# EasyEDA Pro project LED伏安特性实验仪.eprj, schematic 光磁共振

## Sheets
1 主板＋ad: Create Date: 2025-03-17; Page Name: 主板＋ad; Project Name: LED伏安特性实验仪; Schematic Name: 光磁共振; Update Date: 2025-05-20; Company: 嘉立创EDA; Page Size: A4; Version: V1.0
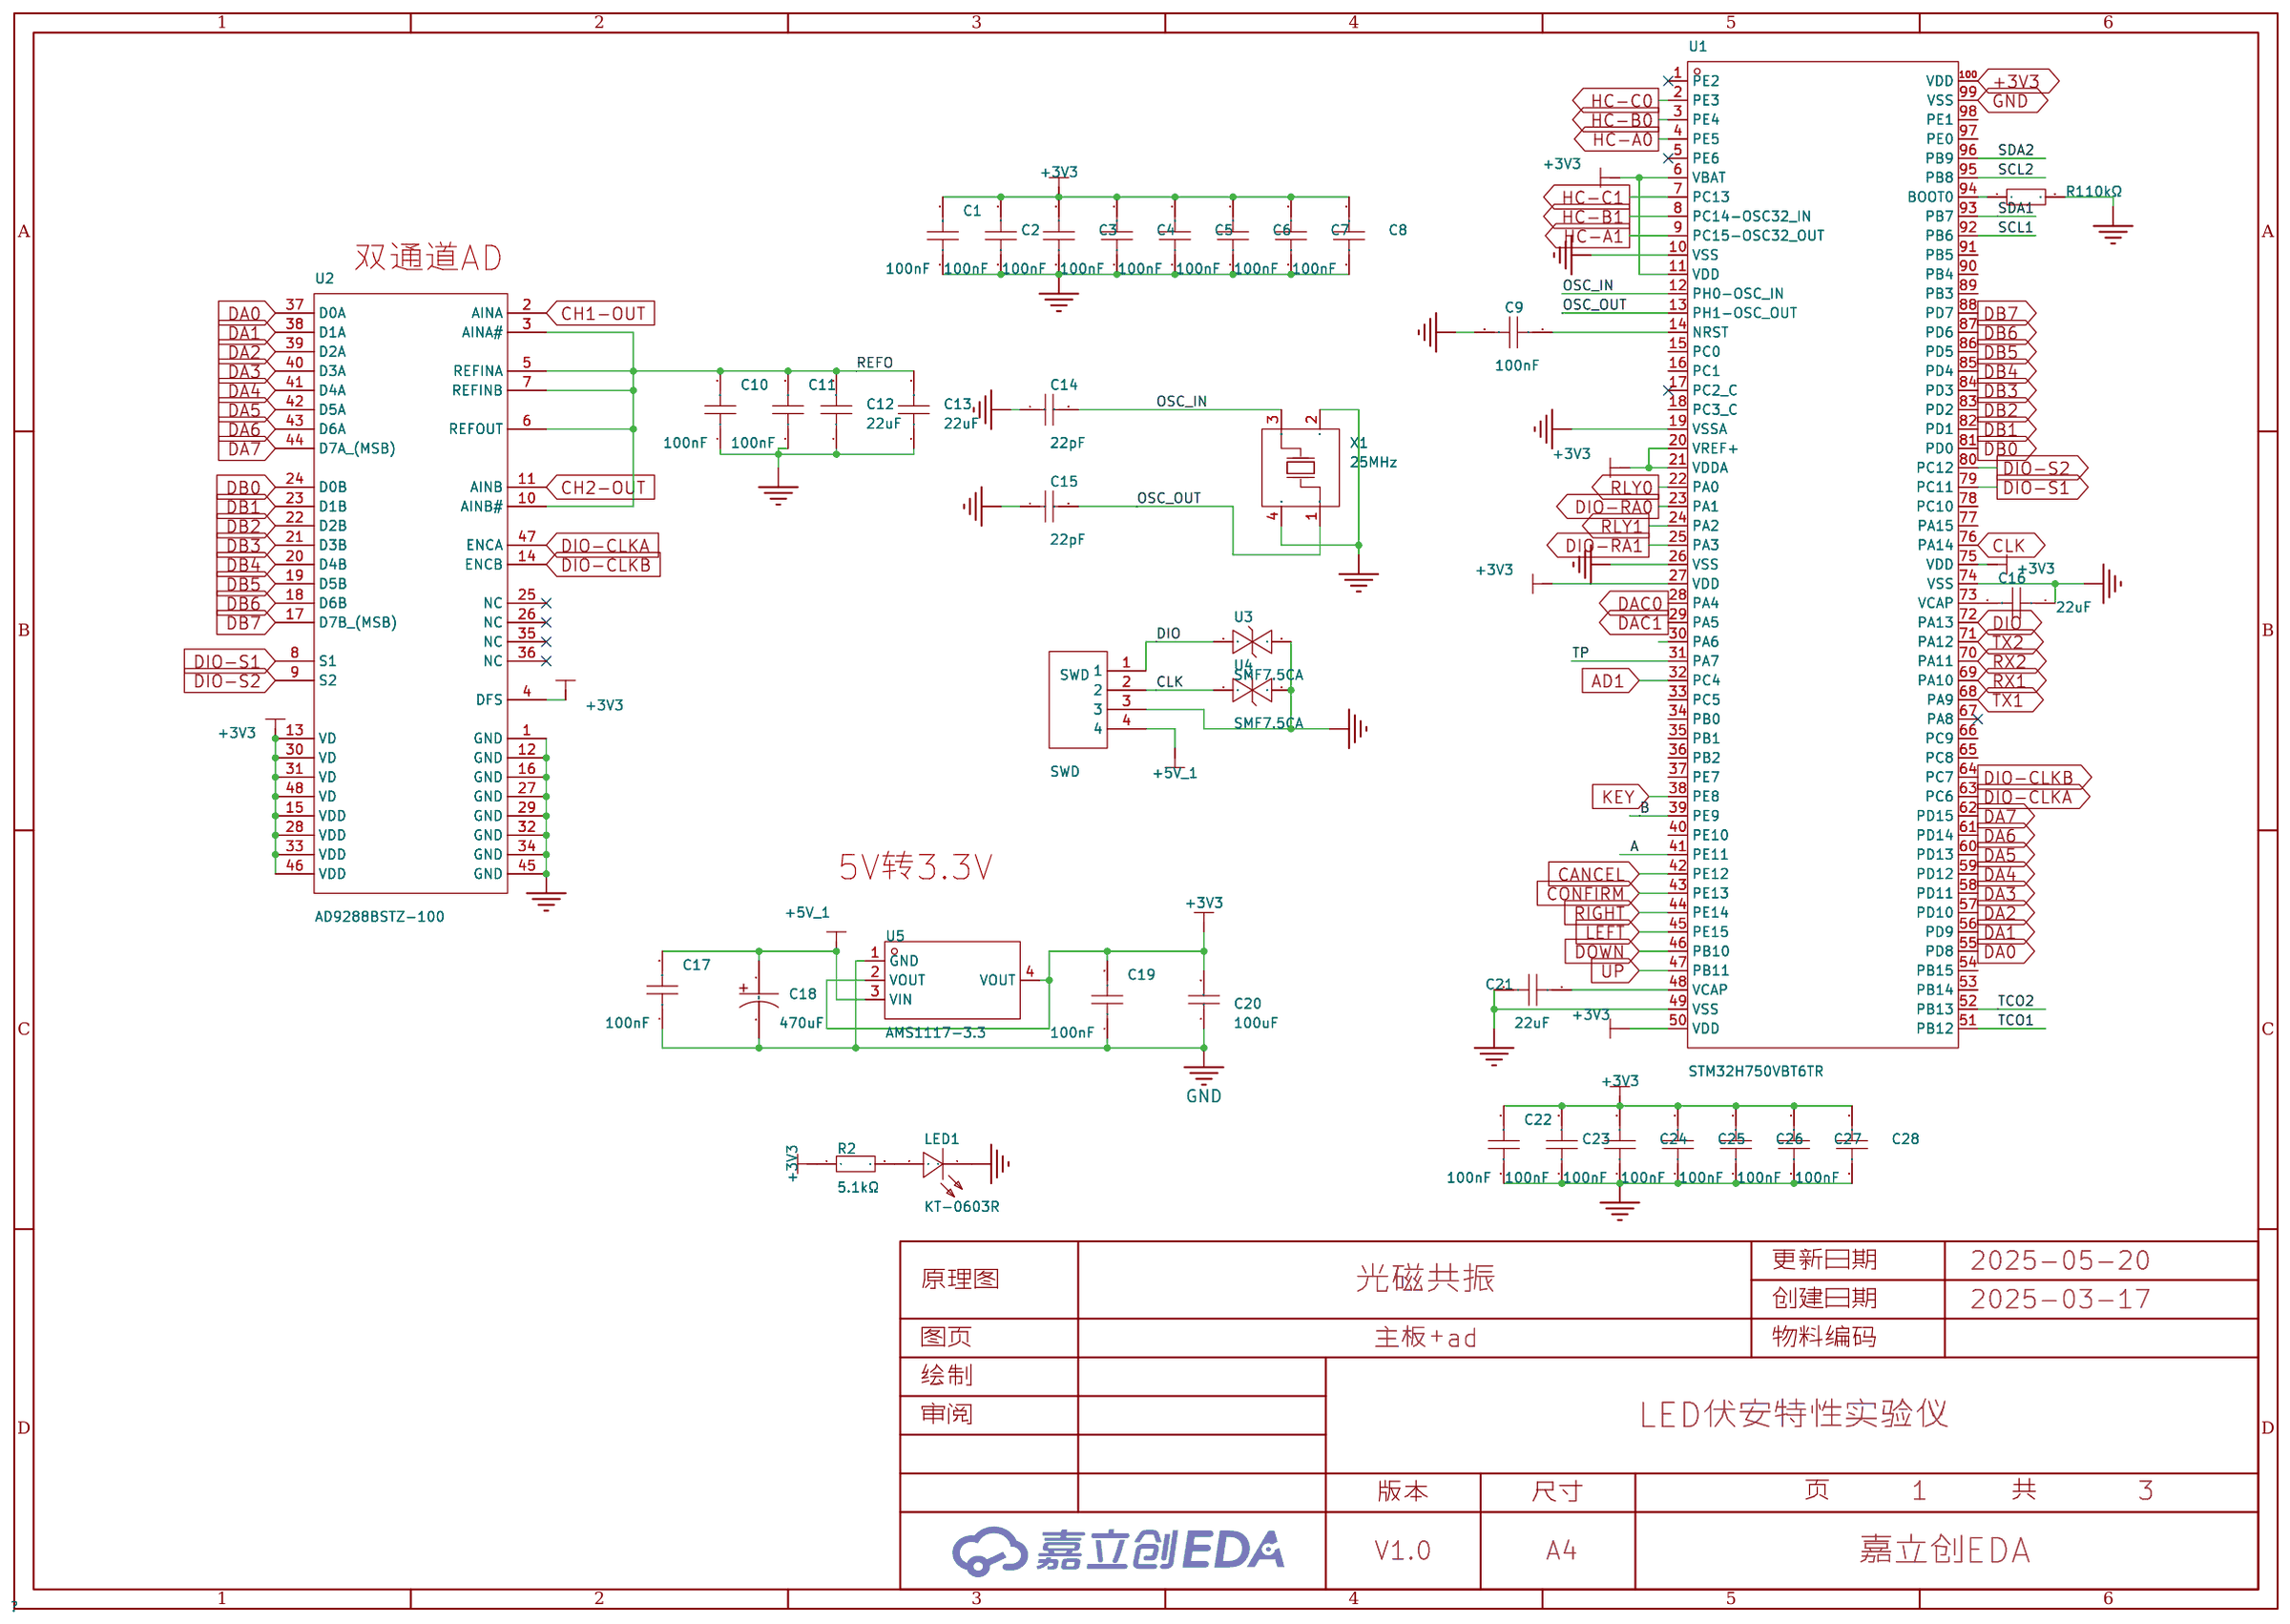
[diagram p0: 主板＋ad]
2 控温、按键、串口等: Page Name: 控温、按键、串口等; Update Date: 2026-06-05
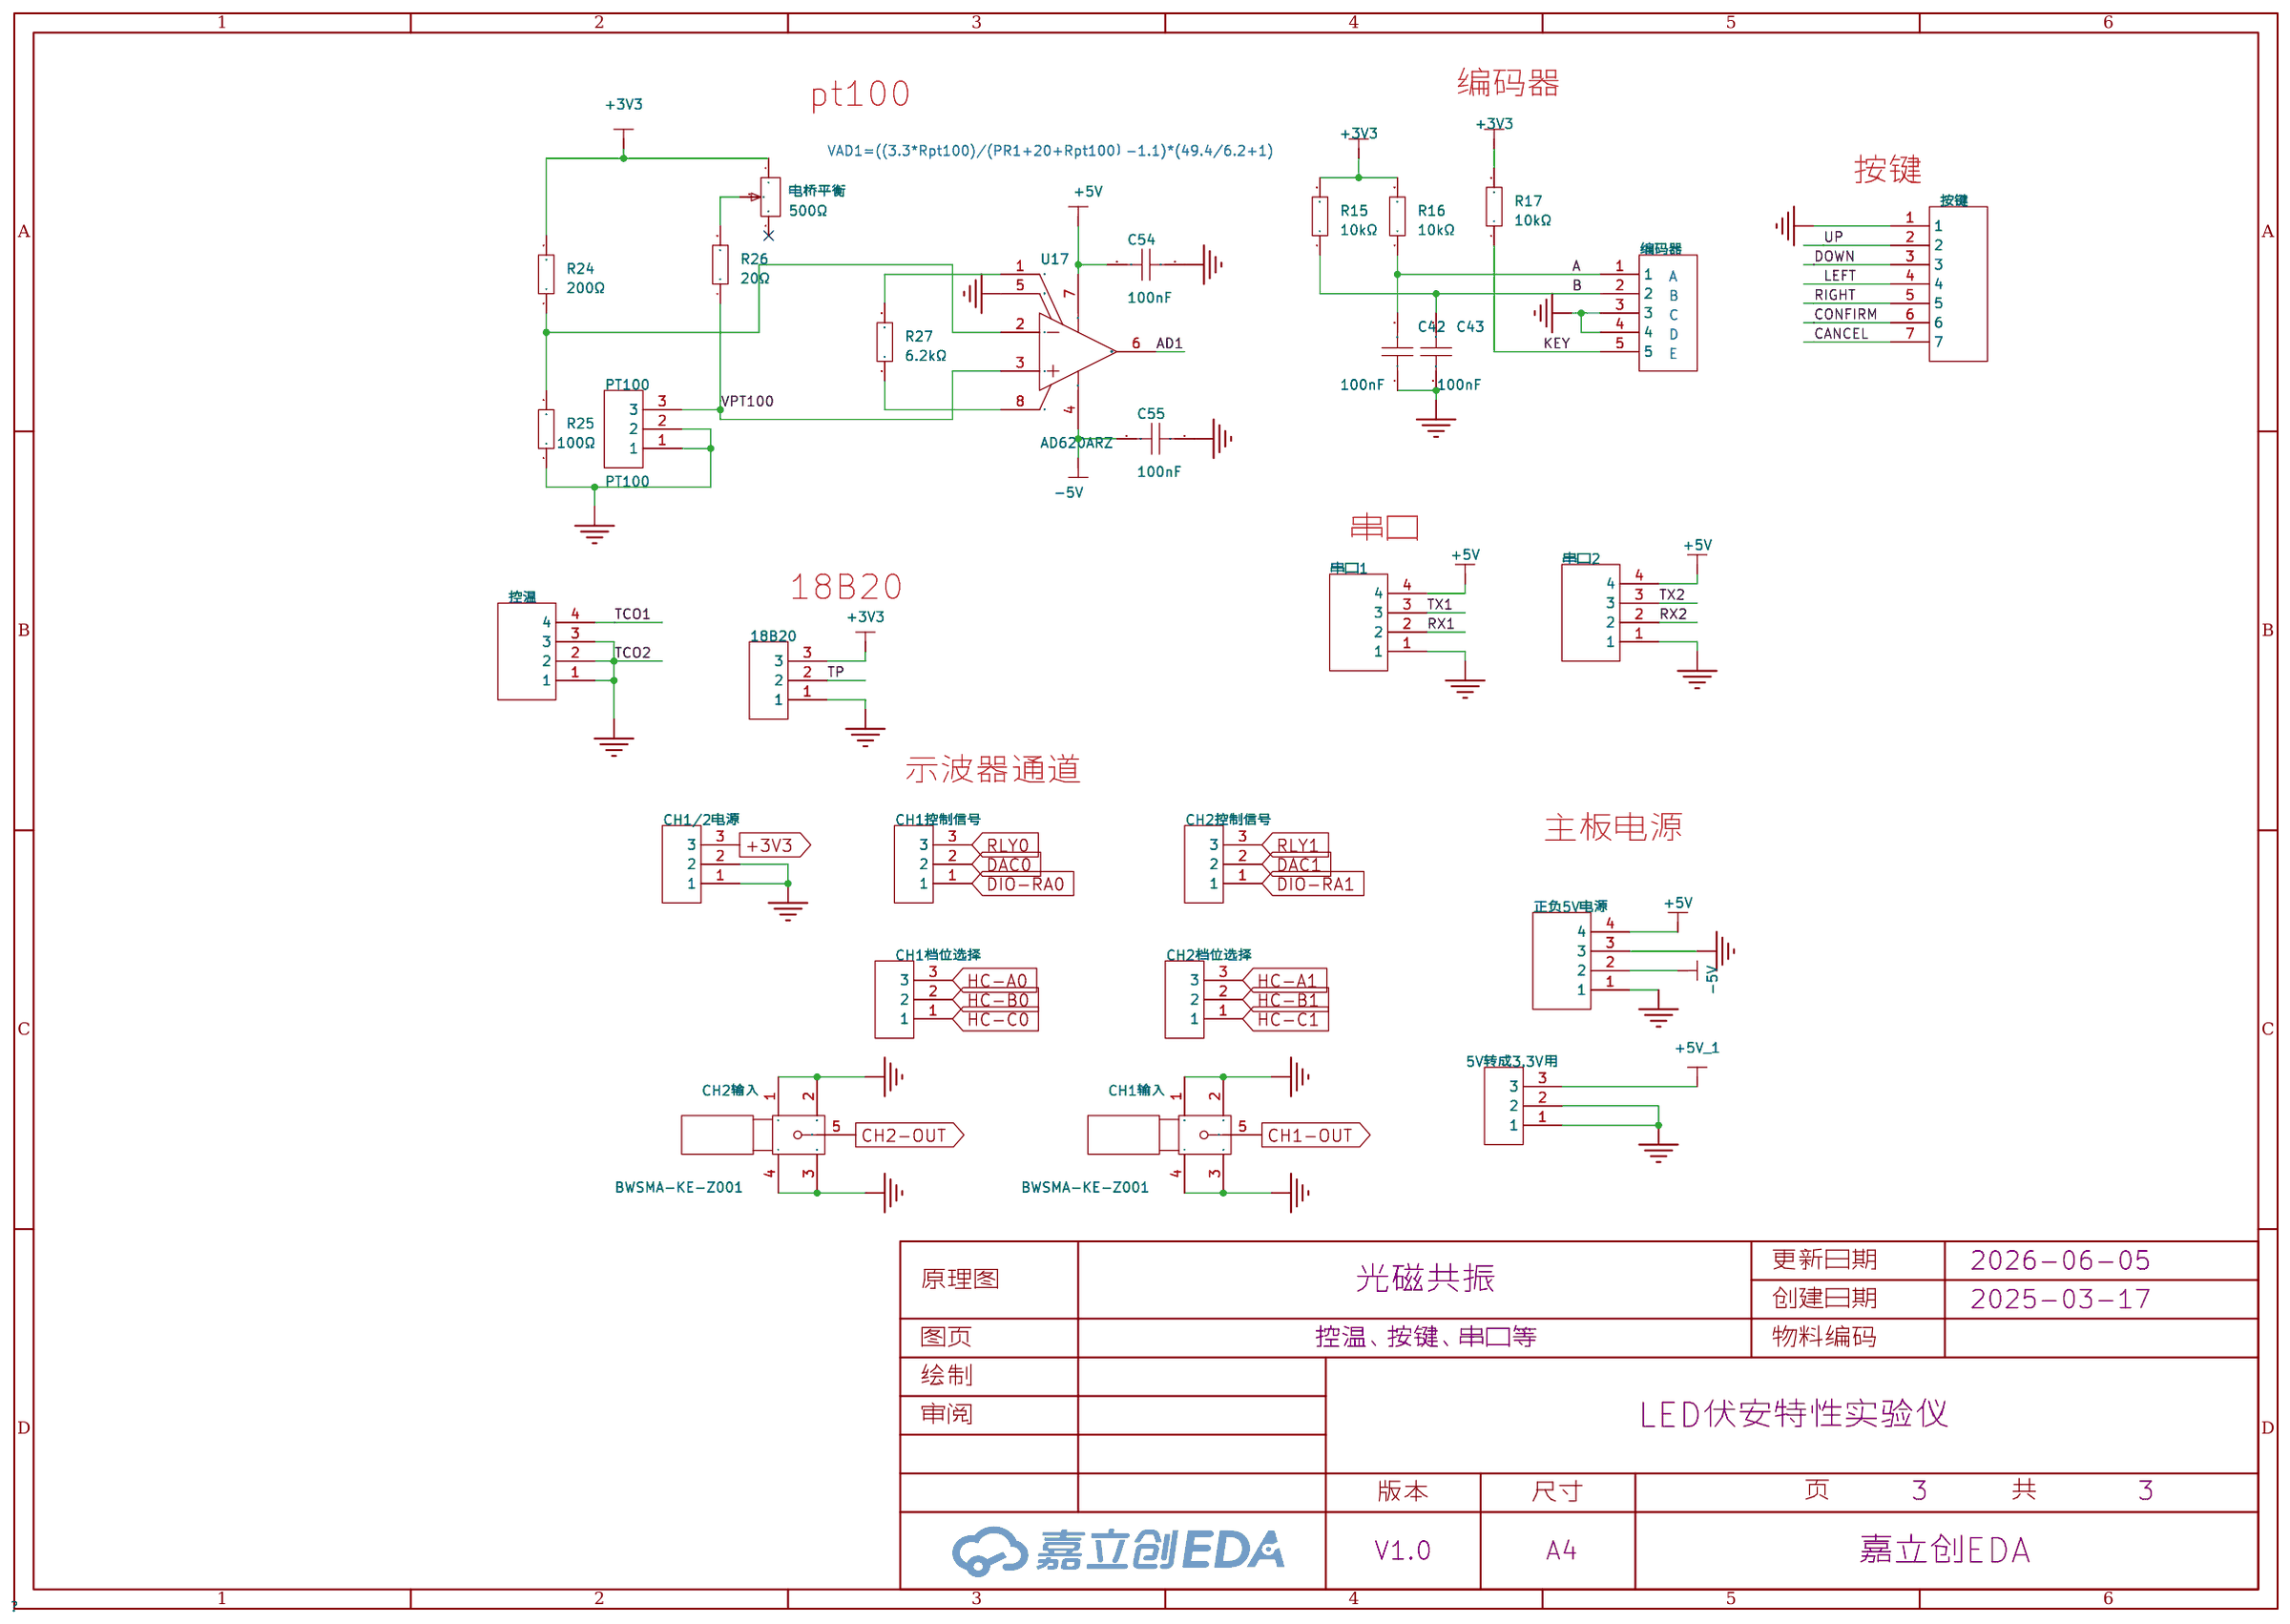
[diagram p1: 控温、按键、串口等]
3 信号输出: Page Name: 信号输出; Update Date: 2026-06-09
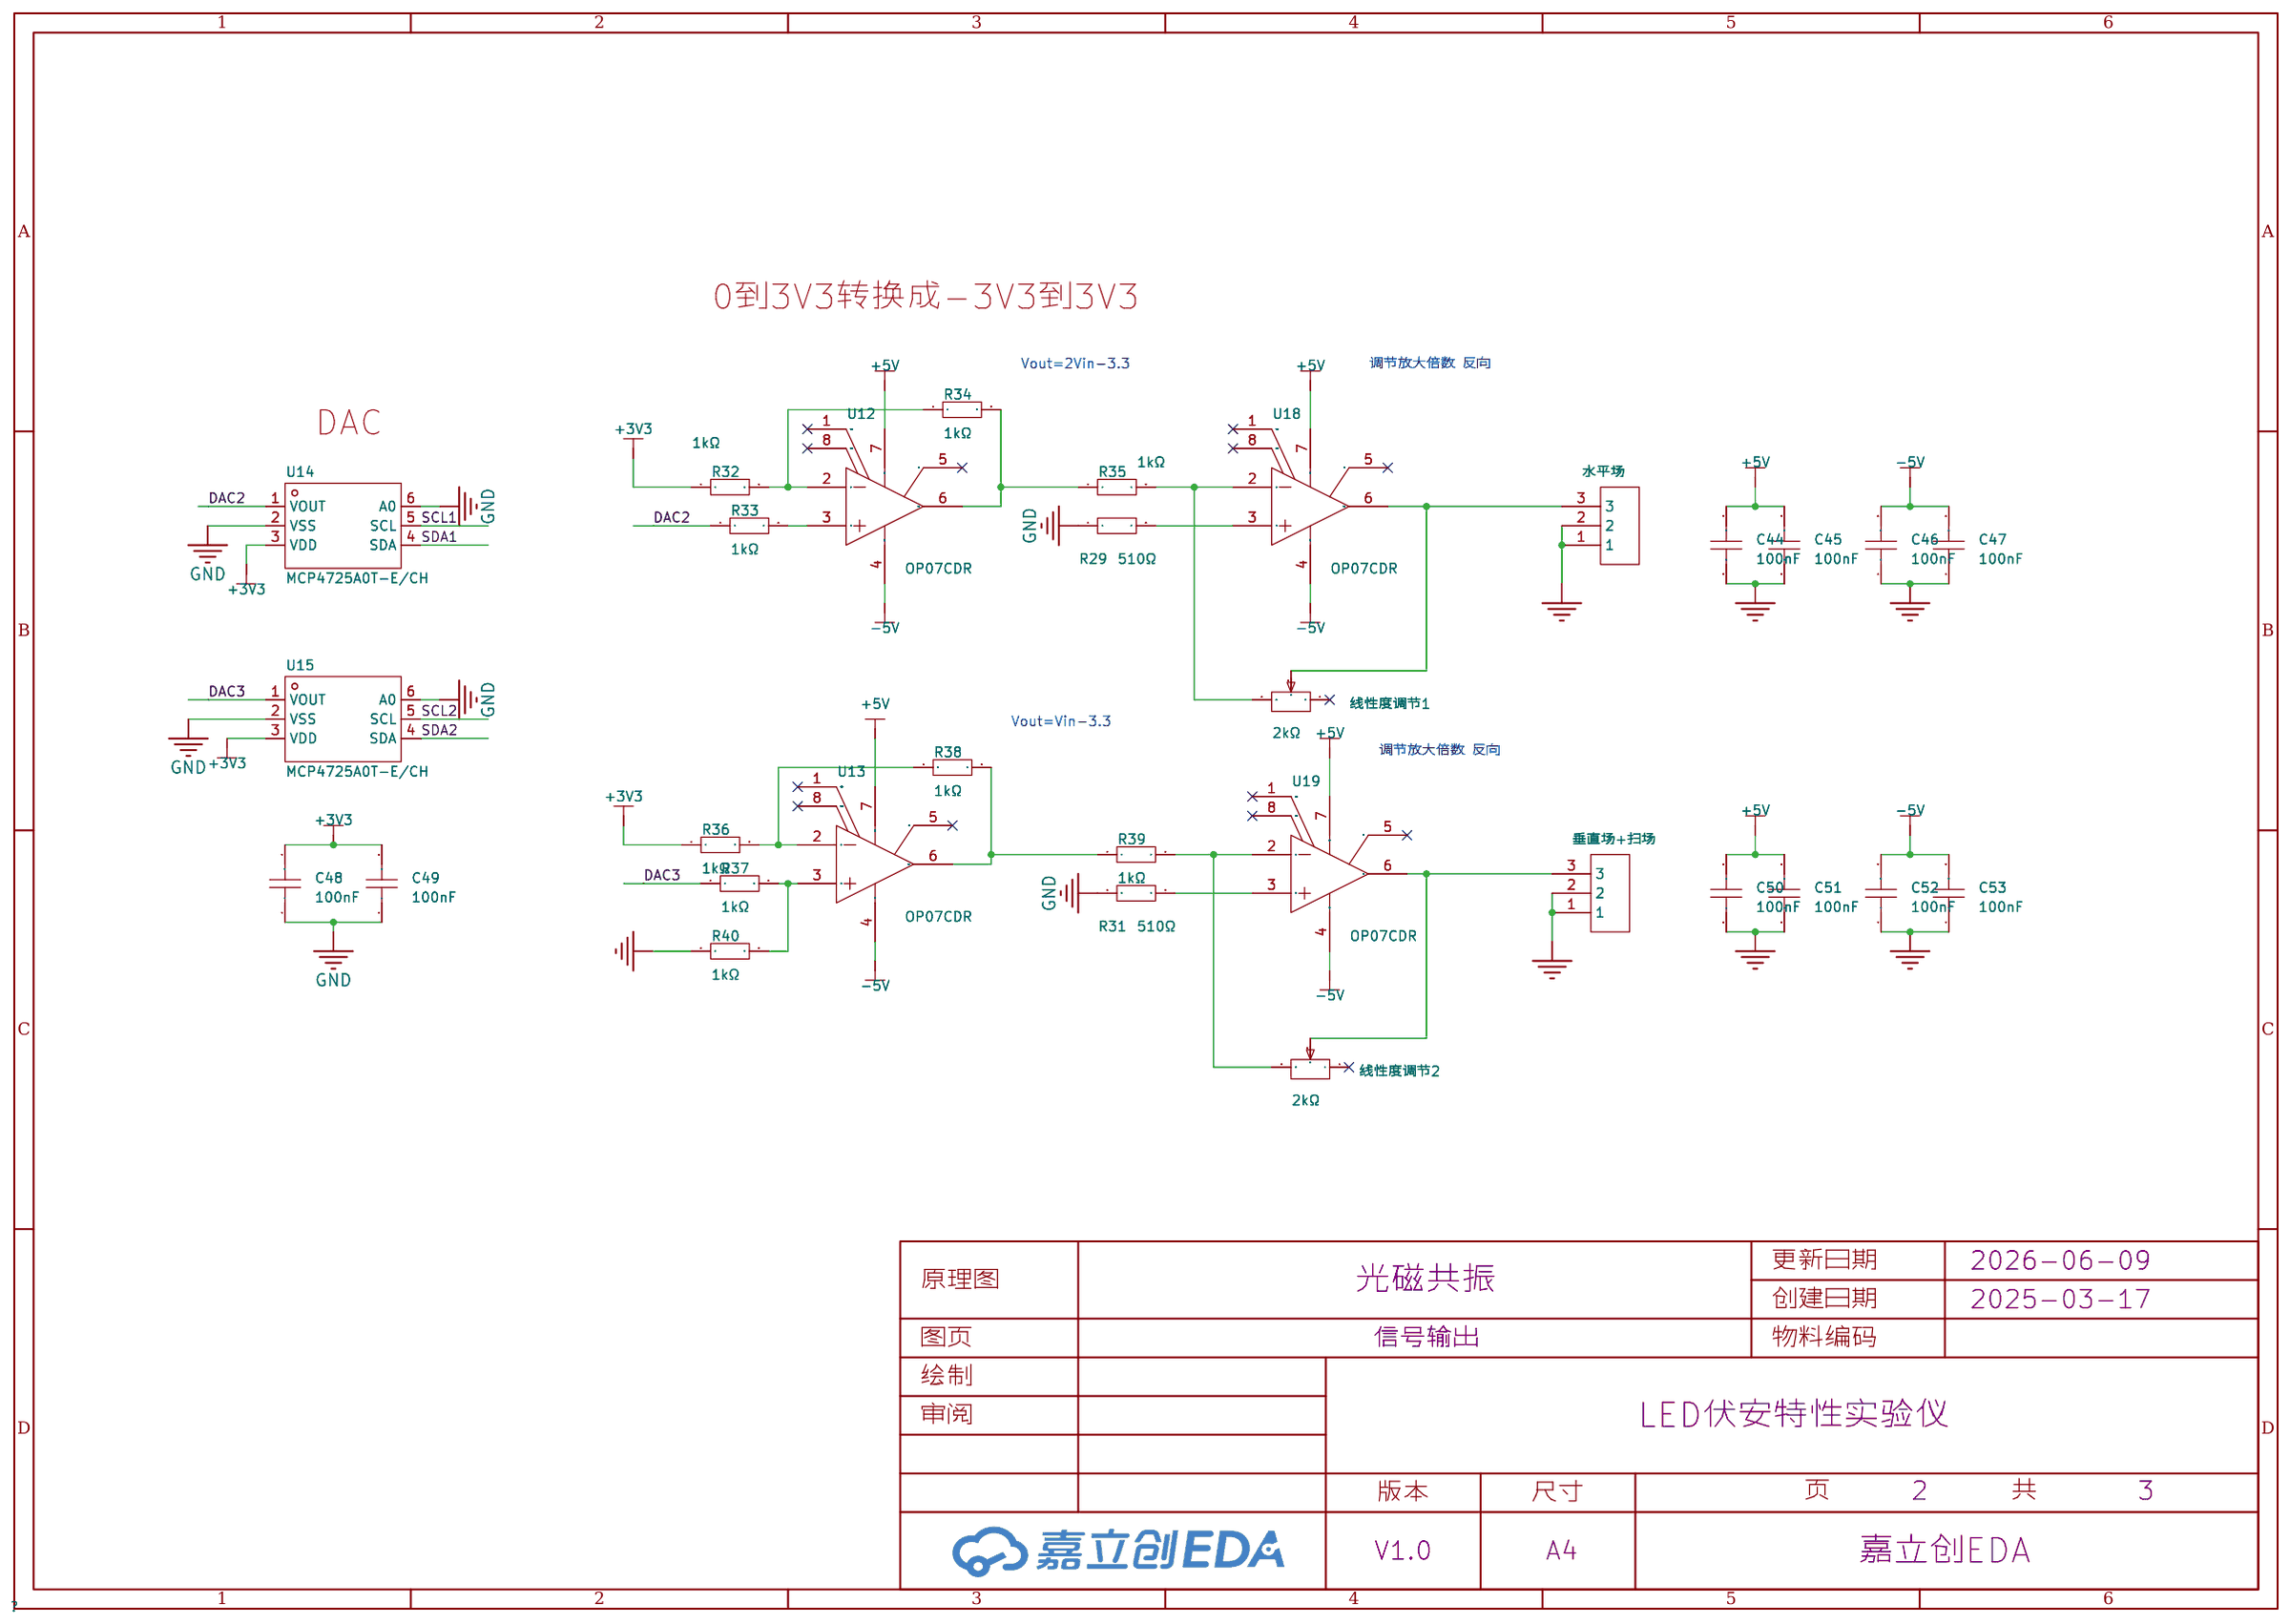
[diagram p2: 信号输出]

## Parts
sheet 主板＋ad
C1  100nF  [C0402]
C2  100nF  [C0402]
C3  100nF  [C0402]
C4  100nF  [C0402]
C5  100nF  [C0402]
C6  100nF  [C0402]
C7  100nF  [C0402]
C8  100nF  [C0402]
C9  100nF  [C0402]
C10  100nF  [C0402]
C11  100nF  [C0402]
C12  22uF  [C0603]
C13  22uF  [C0603]
C14  22pF  [C0603]
C15  22pF  [C0603]
C16  22uF  [C0603]
C17  100nF  [C0402]
C18  470uF  [cap-th_bd8.0-p3.50-d0.6-fd_1]
C19  100nF  [C0402]
C20  100uF  [C1206]
C21  22uF  [C0603]
C22  100nF  [C0402]
C23  100nF  [C0402]
C24  100nF  [C0402]
C25  100nF  [C0402]
C26  100nF  [C0402]
C27  100nF  [C0402]
C28  100nF  [C0402]
LED1  KT-0603R  [LED0603-RD]
R1  10kΩ  [R0402]
R2  5.1kΩ  [R0603]
SWD  SWD  [CH2.54-4插座]
U1  STM32H750VBT6TR  [QFP-100_L14.0-W14.0-P0.50-LS16.0-BL]
U2  AD9288BSTZ-100  [LQFP-48_L7.0-W7.0-P0.50-LS9.0-BL]
U3  SMF7.5CA  [SOD-123FL_L2.8-W1.8-LS3.7-BI]
U4  SMF7.5CA  [SOD-123FL_L2.8-W1.8-LS3.7-BI]
U5  AMS1117-3.3  [SOT-223-3_L6.5-W3.4-P2.30-LS7.0-BR]
X1  25MHz  [OSC-SMD_4P-L3.2-W2.5-BL]
sheet 信号输出
C44  100nF  [C0603]
C45  100nF  [C0603]
C46  100nF  [C0603]
C47  100nF  [C0603]
C48  100nF  [C0603]
C49  100nF  [C0603]
C50  100nF  [C0603]
C51  100nF  [C0603]
C52  100nF  [C0603]
C53  100nF  [C0603]
R29  510Ω  [R0603]
R31  510Ω  [R0603]
R32  1kΩ  [R0603]
R33  1kΩ  [R0603]
R34  1kΩ  [R0603]
R35  1kΩ  [R0603]
R36  1kΩ  [R0603]
R37  1kΩ  [R0603]
R38  1kΩ  [R0603]
R39  1kΩ  [R0603]
R40  1kΩ  [R0603]
U12  OP07CDR  [SOIC-8_L4.9-W3.9-P1.27-LS6.0-BL]
U13  OP07CDR  [SOIC-8_L4.9-W3.9-P1.27-LS6.0-BL]
U14  MCP4725A0T-E/CH  [SOT-23-6_L2.9-W1.6-P0.95-LS2.8-BL]
U15  MCP4725A0T-E/CH  [SOT-23-6_L2.9-W1.6-P0.95-LS2.8-BL]
U18  OP07CDR  [SOIC-8_L4.9-W3.9-P1.27-LS6.0-BL]
U19  OP07CDR  [SOIC-8_L4.9-W3.9-P1.27-LS6.0-BL]
垂直场+扫场  -  [CH2.54-3插座]
水平场  -  [CH2.54-3插座]
线性度调节1  2kΩ  [RES-ADJ-TH_3296W]
线性度调节2  2kΩ  [RES-ADJ-TH_3296W]
sheet 控温、按键、串口等
5V转成3.3V用  -  [CH2.54-3插座]
18B20  -  [CH2.54-3插座]
C42  100nF  [C0402]
C43  100nF  [C0402]
C54  100nF  [C0603]
C55  100nF  [C0603]
CH1/2电源  -  [CH2.54-3插座]
CH1控制信号  -  [CH2.54-3插座]
CH1档位选择  -  [CH2.54-3插座]
CH1输入  BWSMA-KE-Z001  [SMA-TH_BWSMA-KE-Z001]
CH2控制信号  -  [CH2.54-3插座]
CH2档位选择  -  [CH2.54-3插座]
CH2输入  BWSMA-KE-Z001  [SMA-TH_BWSMA-KE-Z001]
PT100  PT100  [CH2.54-3插座]
R15  10kΩ  [R0805]
R16  10kΩ  [R0805]
R17  10kΩ  [R0805]
R24  200Ω  [R0603]
R25  100Ω  [R0603]
R26  20Ω  [R0603]
R27  6.2kΩ  [R0603]
U17  AD620ARZ  [SOIC-8_L4.9-W3.9-P1.27-LS6.0-BL]
串口1  -  [CH2.54-4插座]
串口2  -  [CH2.54-4插座]
按键  -  [CH2.54-7插座]
控温  -  [CH2.54-4插座]
正负5V电源  -  [CH2.54-4插座]
电桥平衡  500Ω  [RES-ADJ-TH_3296W]
编码器  -  [CH2.54-5插座]

## Library data of the parts
C1-C11 C17 C19 C22-C28 C42 C43 = CL05B104KB54PNC: 容值:100nF;精度:±10%;额定电压:50V;材质(温度系数):X7R;; LCSC Part Name: 100nF ±10% 50V; Supplier Part: C307331; Manufacturer: SAMSUNG(三星); Supplier Footprint: 0402; JLCPCB Part Class: 基础库; Datasheet: https://atta.szlcsc.com/upload/public/pdf/source/20160218/1457707763339.pdf; Supplier: LCSC; Tolerance: ±10%; Voltage Rated: 50V; Temperature Coefficient: X7R
C12 C13 C16 C21 = CL10A226MQ8NRNC: 容值:22uF;精度:±20%;额定电压:6.3V;材质(温度系数):X5R;; LCSC Part Name: 22uF ±20% 6.3V; Supplier Part: C59461; Manufacturer: SAMSUNG(三星); Supplier Footprint: 0603; Datasheet: https://atta.szlcsc.com/upload/public/pdf/source/20160218/1457707763339.pdf; Supplier: LCSC; Tolerance: ±20%; Voltage Rated: 6.3V; Temperature Coefficient: X5R
C14 C15 = CL10C220JB8NNNC: 容值:22pF;精度:±5%;额定电压:50V;材质(温度系数):C0G;; LCSC Part Name: 22pF ±5% 50V; Supplier Part: C1653; Manufacturer: SAMSUNG(三星); Supplier Footprint: 0603; JLCPCB Part Class: 基础库; Datasheet: https://atta.szlcsc.com/upload/public/pdf/source/20160218/1457707763339.pdf; Supplier: LCSC; Tolerance: ±5%; Voltage Rated: 50V; Temperature Coefficient: C0G
C18 = RVT1A471M0607_C335982: 容值:470uF;精度:±20%;额定电压:10V;纹波电流:200mA@120Hz;等效串联电阻:-;; LCSC Part Name: 470uF ±20% 10V; Supplier Part: C335982; Manufacturer: ROQANG(容强); Manufacturer Part: RVT1A471M0607; Supplier Footprint: SMD,D6.3xL7.7mm; Datasheet: https://atta.szlcsc.com/upload/public/pdf/source/20181128/C335987_23CA7AA50FB42690DF736C43FE112376.pdf; Supplier: LCSC; Tolerance: ±20%; Rated Voltage: 10V; Ripple Current: 200mA@120Hz; φD: 6.3mm; L: 7.7mm; Lifetime @ Temp: 2000hrs@105℃; Operating Temperature: -40℃~+105℃
C20 = CL31A107MQHNNNE: 容值:100uF;精度:±20%;额定电压:6.3V;材质(温度系数):X5R;; LCSC Part Name: 100uF ±20% 6.3V; Supplier Part: C15008; Manufacturer: SAMSUNG(三星); Supplier Footprint: 1206; Datasheet: https://atta.szlcsc.com/upload/public/pdf/source/20160218/1457707763339.pdf; Supplier: LCSC; Tolerance: ±20%; Voltage Rated: 6.3V; Temperature Coefficient: X5R
LED1 = KT-0603R: 发光颜色:红色;功率:-;正向电流:-;主波长:-;二极管配置:-;透镜颜色:-;色温:-;发光角度:-;载带方式:-;工作温度:-40℃~+85℃;; LCSC Part Name: 0603 红灯 高亮; Supplier Part: C2286; Manufacturer: KENTO; Supplier Footprint: 0603; JLCPCB Part Class: 基础库; Datasheet: https://atta.szlcsc.com/upload/public/pdf/source/20160616/1466072038404.pdf; Supplier: LCSC; Emitted Color: 红色; Operating Temperature: -40℃~+85℃
R1 = 0402WGF1002TCE: 电阻类型:厚膜电阻;阻值:10kΩ;精度:±1%;功率:62.5mW;最大工作电压:50V;温度系数:±100ppm/℃;; LCSC Part Name: 10kΩ ±1% 62.5mW 厚膜电阻; Supplier Part: C25744; Manufacturer: UNI-ROYAL(厚声); Supplier Footprint: 0402; JLCPCB Part Class: 基础库; Datasheet: https://atta.szlcsc.com/upload/public/pdf/source/20200306/C422600_1E6D84923E4A46A82E41ADD87F860B5C.pdf; Supplier: LCSC; Type: 厚膜电阻; Tolerance: ±1%; Power(Watts): 62.5mW; Overload Voltage (Max): 50V; Temperature Coefficient: ±100ppm/℃; Operating Temperature Range: -55℃~+155℃
R2 = 0603WAF5101T5E: 电阻类型:厚膜电阻;阻值:5.1kΩ;精度:±1%;功率:100mW;最大工作电压:75V;温度系数:±100ppm/℃;; LCSC Part Name: 5.1kΩ ±1% 100mW 厚膜电阻; Supplier Part: C23186; Manufacturer: UNI-ROYAL(厚声); Supplier Footprint: 0603; Datasheet: https://atta.szlcsc.com/upload/public/pdf/source/20200306/C422600_1E6D84923E4A46A82E41ADD87F860B5C.pdf; Supplier: LCSC; Type: 厚膜电阻; Tolerance: ±1%; Power(Watts): 100mW; Overload Voltage (Max): 75V; Temperature Coefficient: ±100ppm/℃; Operating Temperature Range: -55℃~+155℃
SWD 串口1 串口2 控温 正负5V电源 = HDR-4P
U1 = STM32H750VBT6TR: CPU内核:-;程序存储容量:128KB;GPIO端口数量:82;工作电压范围:1.62V~3.6V;CPU最大主频:480MHz;; LCSC Part Name: 带DSP和DP-FPU的高性能ARM Cortex-M7 MCU，具有128 KB Flash、1 MB RAM、480 MHz CPU、一级缓存、外部存储器接口、JPEG编解码器、硬件加密和大量外设; Supplier Part: C2969869; Manufacturer: ST(意法半导体); Supplier Footprint: LQFP-100(14x14); JLCPCB Part Class: 扩展库; Datasheet: https://atta.szlcsc.com/upload/public/pdf/source/20210618/C1342741_481536973B33A4EFE007B1B46C2F1F11.pdf; Supplier: LCSC; Program Storage Size: 128KB; GPIO Ports Number: 82; Operating Voltage Range: 1.62V~3.6V; CPU Maximum Speed: 480MHz; Operating Temperature Range: -40℃~+85℃; ADC (Bit): 16bit; DAC (Bit): 12bit; Universal Serial Bus: 有; Watchdog: 有; Infrared Data Association: 有; Low-Voltage Detect: 有; LCD Module: 有; Secure Digital Input and Output: 有; Direct Memory Access: 有; Internal Oscillator: 有
U2 = AD9288BSTZ-100: 接口:并行;电源电压:2.7V~3.6V;采样率:100MHz;分辨率:8位;; Supplier Part: C31151; Manufacturer: ADI(亚德诺); Supplier Footprint: LQFP-48(7x7); JLCPCB Part Class: 扩展库; Datasheet: https://atta.szlcsc.com/upload/public/pdf/source/20140508/1457707057464.pdf; Supplier: LCSC; Interface: 并行; differential input: 是; number of channels: 2; Supply Voltage: 2.7V~3.6V; sampling frequency: 100MHz; resolution: 8位; Operating Temperature: -40℃~+85℃
U3 U4 = SMF7.5CA_C19077503: 极性:双向;反向截止电压(Vrwm):7.5V;最大钳位电压:12.9V;峰值脉冲电流(Ipp)@10/1000us:15.5A;峰值脉冲功率(Ppp)@10/1000us:200W;击穿电压:9.21V;; Supplier Part: C19077503; Manufacturer: 宏迦橙; Supplier Footprint: SOD-123FL; Datasheet: https://atta.szlcsc.com/upload/public/pdf/source/20231129/4813F17DC56F8B344A8D004597B3633C.pdf; Supplier: LCSC; polarity: 双向; Reverse Stand-Off Voltage (Vrwm): 7.5V; Maximum Clamping Voltage: 12.9V; Peak Pulse Current (Ipp)@10/1000us: 15.5A; Peak Pulse Power Dissipation (Ppp)@10/1000us: 200W; Breakdown Voltage: 9.21V; Reverse Leakage Current (Ir): 50uA; Operating Temperature: -55℃~+155℃; Type: TVS
U5 = AMS1117-3.3_C6186: 输出类型:固定;最大输入电压:-;输出电压:3.3V;最大输出电流:1A;电源纹波抑制比(PSRR):72dB@(120Hz);输出极性:正极;; LCSC Part Name: 输出3.3V 1A; Supplier Part: C6186; Manufacturer: AMS; Supplier Footprint: SOT-223; Datasheet: https://atta.szlcsc.com/upload/public/pdf/source/20180727/C6186_7A095716F0823C02F1997A905E26C086.pdf; Supplier: LCSC; Output Type: 固定; Output Voltage: 3.3V; MAX Output Current: 1A; Power Supply Rejection Ratio (PSRR): 72dB@(120Hz); Dropout Voltage: 1.3V@(800mA); Output Polarity: 正极; Number of Outputs: 1
X1 = X322525MOB4SI: 晶振类型:贴片晶振;频率:25MHz;常温频差:±10ppm;外接负载电容:12pF;频率稳定度(全温):±20ppm;; LCSC Part Name: 25MHz ±10ppm 12pF; Supplier Part: C9006; Manufacturer: YXC(扬兴晶振); Supplier Footprint: SMD3225-4P; Datasheet: https://atta.szlcsc.com/upload/public/pdf/source/20240329/19D5F850207469550BEB00D7DFEDBC7A.pdf; Supplier: LCSC; Crystal Type: 贴片晶振; Normal temperature Frequency Tolerance: ±10ppm; External load capacitor: 12pF; Frequency Stability(Full temperature range): ±20ppm; Operating Temperature: -40℃~+85℃
C44-C55 = CC0603KRX7R9BB104: 容值:100nF;精度:±10%;额定电压:50V;材质(温度系数):X7R;; LCSC Part Name: 100nF ±10% 50V; Supplier Part: C14663; Manufacturer: YAGEO(国巨); Supplier Footprint: 0603; JLCPCB Part Class: 基础库; Datasheet: https://atta.szlcsc.com/upload/public/pdf/source/20180910/C282072_33301C7F631E79921B82A8DAC6BCC5B3.pdf; Supplier: LCSC; Tolerance: ±10%; Voltage Rated: 50V; Temperature Coefficient: X7R
R29 R31 = 0603WAF5100T5E: 电阻类型:厚膜电阻;阻值:510Ω;精度:±1%;功率:100mW;最大工作电压:75V;温度系数:±100ppm/℃;; LCSC Part Name: 510Ω ±1% 100mW 厚膜电阻; Supplier Part: C23193; Manufacturer: UNI-ROYAL(厚声); Supplier Footprint: 0603; JLCPCB Part Class: 基础库; Datasheet: https://atta.szlcsc.com/upload/public/pdf/source/20200306/C422600_1E6D84923E4A46A82E41ADD87F860B5C.pdf; Supplier: LCSC; Type: 厚膜电阻; Tolerance: ±1%; Power(Watts): 100mW; Overload Voltage (Max): 75V; Temperature Coefficient: ±100ppm/℃; Operating Temperature Range: -55℃~+155℃
R32-R40 = 0603WAF1001T5E: 电阻类型:厚膜电阻;阻值:1kΩ;精度:±1%;功率:100mW;最大工作电压:75V;温度系数:±100ppm/℃;; LCSC Part Name: 1kΩ ±1% 100mW 厚膜电阻; Supplier Part: C21190; Manufacturer: UNI-ROYAL(厚声); Supplier Footprint: 0603; JLCPCB Part Class: 基础库; Datasheet: https://atta.szlcsc.com/upload/public/pdf/source/20200306/C422600_1E6D84923E4A46A82E41ADD87F860B5C.pdf; Supplier: LCSC; Type: 厚膜电阻; Tolerance: ±1%; Power(Watts): 100mW; Overload Voltage (Max): 75V; Temperature Coefficient: ±100ppm/℃; Operating Temperature Range: -55℃~+155℃
U12 U13 U18 U19 = OP07CDR: 放大器数:单路;增益带宽积(GBP):600kHz;输入偏置电流(Ib):1.8nA;压摆率(SR):0.3V/us;轨到轨:-;; LCSC Part Name: 精密运算放大器; Supplier Part: C7433; Manufacturer: TI(德州仪器); Supplier Footprint: SOIC-8; JLCPCB Part Class: 基础库; Datasheet: http://www.ti.com/cn/lit/gpn/op07c; Supplier: LCSC; Number of Circuits: 单路; Gain Bandwidth Product(GBP): 600kHz; Current - Input Bias(Ib): 1.8nA; Slew Rate(SR): 0.3V/us; Operating Temperature: 0℃~+70℃
U14 U15 = MCP4725A0T-E/CH: 接口:I2C;电源电压:2.7V~5.5V;分辨率:12;INL/DNL:±2LSB;稳定时间:6us;; Supplier Part: C144198; Manufacturer: MICROCHIP(美国微芯); Supplier Footprint: SOT-23-6; JLCPCB Part Class: 扩展库; Datasheet: https://atta.szlcsc.com/upload/public/pdf/source/20180115/C144198_15159965569901268427.pdf; Supplier: LCSC; Interface: I2C; Number of Channels: 1; Output Type: 电压-缓冲; Supply Voltage: 2.7V~5.5V; Resolution: 12; Integral nonlinearity: ±2LSB; Settling Time: 6us; Operating Temperature: -40℃~+125℃
5V转成3.3V用 18B20 CH1/2电源 CH1控制信号 CH1档位选择 CH2控制信号 CH2档位选择 PT100 垂直场+扫场 水平场 = HDR-3P
电桥平衡 线性度调节1 线性度调节2 = 环保 3296W-1-102LF: 阻值:-;功率:-;; LCSC Part Name: 1KΩ; Supplier Part: C5025; Supplier Footprint: VR-3296W; JLCPCB Part Class: 扩展库; Supplier: LCSC
CH1输入 CH2输入 = BWSMA-KE-Z001_C496549: 连接器类型:板端;接口类型:内孔;端口数量:1;接口直径:-;接口长度/高度:-;频率-最大值:-;射频系列:SMA;阻抗:50Ω;样式:正脚;触头材质:-;触头镀层:-;工作温度范围:-65℃~+165℃;焊接温度(最大值):-;; LCSC Part Name: 内孔 SMA 正脚; Supplier Part: C496549; Manufacturer: BAT WIRELESS(蝙蝠无线); Supplier Footprint: 插件; Datasheet: https://atta.szlcsc.com/upload/public/pdf/source/20221228/40BF41E56A06003A0210E1785CA66EA6.pdf; Supplier: LCSC; Connector Type: 板端; Interface Type: 内孔; Number of Ports: 1; RF Series: SMA; Impedance: 50Ω; Style: 正脚; Operating Temperature Range: -65℃~+165℃
R15-R17 = 0805W8F1002T5E_C17414: 电阻类型:厚膜电阻;阻值:10kΩ;精度:±1%;功率:125mW;最大工作电压:150V;温度系数:±100ppm/℃;; LCSC Part Name: 10kΩ ±1% 125mW 厚膜电阻; Supplier Part: C17414; Manufacturer: UNI-ROYAL(厚声); Manufacturer Part: 0805W8F1002T5E; Supplier Footprint: 0805; JLCPCB Part Class: 基础库; Datasheet: https://atta.szlcsc.com/upload/public/pdf/source/20200306/C422600_1E6D84923E4A46A82E41ADD87F860B5C.pdf; Supplier: LCSC; Type: 厚膜电阻; Tolerance: ±1%; Power(Watts): 125mW; Overload Voltage (Max): 150V; Temperature Coefficient: ±100ppm/℃; Operating Temperature Range: -55℃~+155℃
R24 = 0603WAF2000T5E: 电阻类型:厚膜电阻;阻值:200Ω;精度:±1%;功率:100mW;最大工作电压:75V;温度系数:±100ppm/℃;; LCSC Part Name: 200Ω ±1% 100mW 厚膜电阻; Supplier Part: C8218; Manufacturer: UNI-ROYAL(厚声); Supplier Footprint: 0603; JLCPCB Part Class: 基础库; Datasheet: https://atta.szlcsc.com/upload/public/pdf/source/20200306/C422600_1E6D84923E4A46A82E41ADD87F860B5C.pdf; Supplier: LCSC; Type: 厚膜电阻; Tolerance: ±1%; Power(Watts): 100mW; Overload Voltage (Max): 75V; Temperature Coefficient: ±100ppm/℃; Operating Temperature Range: -55℃~+155℃
R25 = 0603WAF1000T5E: 电阻类型:厚膜电阻;阻值:100Ω;精度:±1%;功率:100mW;最大工作电压:75V;温度系数:±200ppm/℃;; LCSC Part Name: 100Ω ±1% 100mW 厚膜电阻; Supplier Part: C22775; Manufacturer: UNI-ROYAL(厚声); Supplier Footprint: 0603; JLCPCB Part Class: 基础库; Datasheet: https://atta.szlcsc.com/upload/public/pdf/source/20200306/C422600_1E6D84923E4A46A82E41ADD87F860B5C.pdf; Supplier: LCSC; Type: 厚膜电阻; Tolerance: ±1%; Power(Watts): 100mW; Overload Voltage (Max): 75V; Temperature Coefficient: ±200ppm/℃; Operating Temperature Range: -55℃~+155℃
R26 = 0603WAF200JT5E: 电阻类型:厚膜电阻;阻值:20Ω;精度:±1%;功率:100mW;最大工作电压:75V;温度系数:±100ppm/℃;; LCSC Part Name: 20Ω ±1% 100mW 厚膜电阻; Supplier Part: C22950; Manufacturer: UNI-ROYAL(厚声); Supplier Footprint: 0603; JLCPCB Part Class: 基础库; Datasheet: https://atta.szlcsc.com/upload/public/pdf/source/20200306/C422600_1E6D84923E4A46A82E41ADD87F860B5C.pdf; Supplier: LCSC; Type: 厚膜电阻; Tolerance: ±1%; Power(Watts): 100mW; Overload Voltage (Max): 75V; Temperature Coefficient: ±100ppm/℃; Operating Temperature Range: -55℃~+155℃
R27 = 0603WAF6201T5E: 电阻类型:厚膜电阻;阻值:6.2kΩ;精度:±1%;功率:100mW;最大工作电压:75V;温度系数:±100ppm/℃;; LCSC Part Name: 6.2kΩ ±1% 100mW 厚膜电阻; Supplier Part: C4260; Manufacturer: UNI-ROYAL(厚声); Supplier Footprint: 0603; JLCPCB Part Class: 基础库; Datasheet: https://atta.szlcsc.com/upload/public/pdf/source/20200306/C422600_1E6D84923E4A46A82E41ADD87F860B5C.pdf; Supplier: LCSC; Type: 厚膜电阻; Tolerance: ±1%; Power(Watts): 100mW; Overload Voltage (Max): 75V; Temperature Coefficient: ±100ppm/℃; Operating Temperature Range: -55℃~+155℃
U17 = AD620ARZ: 放大器数:单路;输入偏置电流(Ib):500pA;输入失调电压(Vos):30uV;增益带宽积(GBP):-;压摆率(SR):1.2V/us;带宽(-3db):1MHz;; LCSC Part Name: 低漂移、低功耗仪表放大器，增益设置范围1至10000; Supplier Part: C578332; Manufacturer: ADI(亚德诺); Supplier Footprint: SOIC-8; JLCPCB Part Class: 扩展库; Datasheet: https://atta.szlcsc.com/upload/public/pdf/source/20190712/C392899_954E4CF05BC1DA3D78A99C9B802C8C83.pdf; Supplier: LCSC; Number of Circuits: 单路; Current - Input Bias(Ib): 500pA; Voltage - Input Offset(Vos): 30uV; Slew Rate(SR): 1.2V/us; -3db Bandwidth: 1MHz; Operating Temperature: -40℃~+85℃
按键 = HDR-7P
编码器 = HDR-5P

## Nets
+3V3: 18B20.3 C1.2 C2.2 C3.2 C4.2 C5.2 C6.2 C7.2 C8.2 C19.2 C20.2 C22.2 C23.2 C24.2 C25.2 C26.2 C27.2 C28.2 C48.2 C49.2 CH1/2电源.3 R2.1 R15.2 R16.2 R17.2 R24.2 R32.1 R36.1 U1.6(VBAT) U1.11(VDD) U1.20(VREF+) U1.21(VDDA) U1.27(VDD) U1.50(VDD) U1.75(VDD) U1.100(VDD) U2.4(DFS) U2.13(VD) U2.15(VDD) U2.28(VDD) U2.30(VD) U2.31(VD) U2.33(VDD) U2.46(VDD) U2.48(VD) U5.2(VOUT) U5.4(VOUT) U14.3(VDD) U15.3(VDD) 电桥平衡.1
+5V: C44.2 C45.2 C50.2 C51.2 C54.2 U12.7(VCC+) U13.7(VCC+) U17.7(+VS) U18.7(VCC+) U19.7(VCC+) 串口1.4 串口2.4 正负5V电源.4
+5V_1: 5V转成3.3V用.3 C17.2 C18.1 SWD.4 U5.3(VIN)
-5V: C46.2 C47.2 C52.2 C53.2 C55.2 U12.4(VCC-) U13.4(VCC-) U17.4(–VS) U18.4(VCC-) U19.4(VCC-) 正负5V电源.2
GND: 5V转成3.3V用.1 5V转成3.3V用.2 18B20.1 C1.1 C2.1 C3.1 C4.1 C5.1 C6.1 C7.1 C8.1 C9.2 C10.1 C11.1 C12.1 C13.1 C14.1 C15.1 C16.1 C17.1 C18.2 C19.1 C20.1 C21.2 C22.1 C23.1 C24.1 C25.1 C26.1 C27.1 C28.1 C42.1 C43.1 C44.1 C45.1 C46.1 C47.1 C48.1 C49.1 C50.1 C51.1 C52.1 C53.1 C54.1 C55.1 CH1/2电源.1 CH1/2电源.2 CH1输入.1 CH1输入.2 CH1输入.3 CH1输入.4 CH2输入.1 CH2输入.2 CH2输入.3 CH2输入.4 LED1.1(K) PT100.1 PT100.2 R1.2 R25.1 R29.1 R31.1 R40.1 SWD.3 U1.10(VSS) U1.19(VSSA) U1.26(VSS) U1.49(VSS) U1.74(VSS) U1.99(VSS) U2.1(GND) U2.12(GND) U2.16(GND) U2.27(GND) U2.29(GND) U2.32(GND) U2.34(GND) U2.45(GND) U3.2 U4.2 U5.1(GND) U14.2(VSS) U14.6(A0) U15.2(VSS) U15.6(A0) U17.5(REF) X1.2(GND) X1.4(GND) 串口1.1 串口2.1 垂直场+扫场.1 垂直场+扫场.2 按键.1 控温.1 控温.3 正负5V电源.1 正负5V电源.3 水平场.1 水平场.2 编码器.3 编码器.4
A: C42.2 R16.1 U1.41(PE11) 编码器.1
AD1: U1.32(PC4) U17.6(OUTPUT)
B: C43.2 R15.1 U1.39(PE9) 编码器.2
CANCEL: U1.42(PE12) 按键.7
CH1-OUT: CH1输入.5 U2.2(AINA)
CH2-OUT: CH2输入.5 U2.11(AINB)
CLK: SWD.2 U1.76(PA14) U4.1
CONFIRM: U1.43(PE13) 按键.6
DA0: U1.55(PD8) U2.37(D0A)
DA1: U1.56(PD9) U2.38(D1A)
DA2: U1.57(PD10) U2.39(D2A)
DA3: U1.58(PD11) U2.40(D3A)
DA4: U1.59(PD12) U2.41(D4A)
DA5: U1.60(PD13) U2.42(D5A)
DA6: U1.61(PD14) U2.43(D6A)
DA7: U1.62(PD15) U2.44(D7A (MSB))
DAC0: CH1控制信号.2 U1.28(PA4)
DAC1: CH2控制信号.2 U1.29(PA5)
DAC2: R33.1 U14.1(VOUT)
DAC3: R37.1 U15.1(VOUT)
DB0: U1.81(PD0) U2.24(D0B)
DB1: U1.82(PD1) U2.23(D1B)
DB2: U1.83(PD2) U2.22(D2B)
DB3: U1.84(PD3) U2.21(D3B)
DB4: U1.85(PD4) U2.20(D4B)
DB5: U1.86(PD5) U2.19(D5B)
DB6: U1.87(PD6) U2.18(D6B)
DB7: U1.88(PD7) U2.17(D7B (MSB))
DIO: SWD.1 U1.72(PA13) U3.1
DIO-CLKA: U1.63(PC6) U2.47(ENCA)
DIO-CLKB: U1.64(PC7) U2.14(ENCB)
DIO-RA0: CH1控制信号.1 U1.23(PA1)
DIO-RA1: CH2控制信号.1 U1.25(PA3)
DIO-S1: U1.79(PC11) U2.8(S1)
DIO-S2: U1.80(PC12) U2.9(S2)
DOWN: U1.46(PB10) 按键.3
HC-A0: CH1档位选择.3 U1.4(PE5)
HC-A1: CH2档位选择.3 U1.9(PC15-OSC32_OUT)
HC-B0: CH1档位选择.2 U1.3(PE4)
HC-B1: CH2档位选择.2 U1.8(PC14-OSC32_IN)
HC-C0: CH1档位选择.1 U1.2(PE3)
HC-C1: CH2档位选择.1 U1.7(PC13)
KEY: R17.1 U1.38(PE8) 编码器.5
LEFT: U1.45(PE15) 按键.4
OSC_IN: C14.2 U1.12(PH0-OSC_IN) X1.3(OSC2)
OSC_OUT: C15.2 U1.13(PH1-OSC_OUT) X1.1(OSC1)
REFO: C10.2 C11.2 C12.2 C13.2 U2.3(AINA#) U2.5(REFINA) U2.6(REFOUT) U2.7(REFINB) U2.10(AINB#)
RIGHT: U1.44(PE14) 按键.5
RLY0: CH1控制信号.3 U1.22(PA0)
RLY1: CH2控制信号.3 U1.24(PA2)
RX1: U1.69(PA10) 串口1.2
RX2: U1.70(PA11) 串口2.2
SCL1: U1.92(PB6) U14.5(SCL)
SCL2: U1.95(PB8) U15.5(SCL)
SDA1: U1.93(PB7) U14.4(SDA)
SDA2: U1.96(PB9) U15.4(SDA)
TCO1: U1.51(PB12) 控温.4
TCO2: U1.52(PB13) 控温.2
TP: 18B20.2 U1.31(PA7)
TX1: U1.68(PA9) 串口1.3
TX2: U1.71(PA12) 串口2.3
UP: U1.47(PB11) 按键.2
VPT100: PT100.3 R26.1 U17.3(IN+)
$1N2879: C9.1 U1.14(NRST)
$1N2903: C21.1 U1.48(VCAP)
$1N2939: R1.1 U1.94(BOOT0)
$1N2967: C16.2 U1.73(VCAP)
$1N2975: LED1.2(A) R2.2
$2N471: R26.2 电桥平衡.2
$2N1715: R24.1 R25.2 U17.2(IN-)
$2N1740: R27.2 U17.1(RG)
$2N1747: R27.1 U17.8(RG)
$3N343: R33.2 U12.3(IN+)
$3N344: R32.2 R34.1 U12.2(IN-)
$3N1680: R35.2 U18.2(IN-) 线性度调节1.3
$3N1690: R34.2 R35.1 U12.6(OUT)
$3N1699: R29.2 U18.3(IN+)
$3N2013: R39.2 U19.2(IN-) 线性度调节2.3
$3N2020: R31.2 U19.3(IN+)
$3N2049: U19.6(OUT) 垂直场+扫场.3 线性度调节2.2
$3N2080: R38.2 R39.1 U13.6(OUT)
$3N2089: U18.6(OUT) 水平场.3 线性度调节1.2
$3N6081: R36.2 R38.1 U13.2(IN-)
$3N6171: R37.2 R40.2 U13.3(IN+)

Not connected (* = marked no-connect by the designer): U1 1(PE2)* 5(PE6)* 15(PC0) 16(PC1) 17(PC2_C)* 18(PC3_C) 30(PA6) 33(PC5) 34(PB0) 35(PB1) 36(PB2) 37(PE7) 40(PE10) 53(PB14) 54(PB15) 65(PC8) 66(PC9) 67(PA8)* 77(PA15) 78(PC10) 89(PB3) 90(PB4) 91(PB5) 97(PE0) 98(PE1); U2 25(NC)* 26(NC)* 35(NC)* 36(NC)*; U12 1(OFFSET N1)* 5(NC)* 8(OFFSET N2)*; U13 1(OFFSET N1)* 5(NC)* 8(OFFSET N2)*; U18 1(OFFSET N1)* 5(NC)* 8(OFFSET N2)*; U19 1(OFFSET N1)* 5(NC)* 8(OFFSET N2)*; 电桥平衡 3*; 线性度调节1 1*; 线性度调节2 1*

## Notes on the sheets
sheet 1
- 双通道AD
- 5V转3.3V
sheet 2
- pt100
- 编码器
- VAD1=((3.3*Rpt100)/(PR1+20+Rpt100）-1.1)*(49.4/6.2+1)
- 按键
- A
- B
- C
- D
- E
- 串口
- 18B20
- 示波器通道
- 主板电源
sheet 3
- 0到3V3转换成-3V3到3V3
- Vout=2Vin-3.3
- 调节放大倍数 反向
- DAC
- Vout=Vin-3.3
- 调节放大倍数 反向
